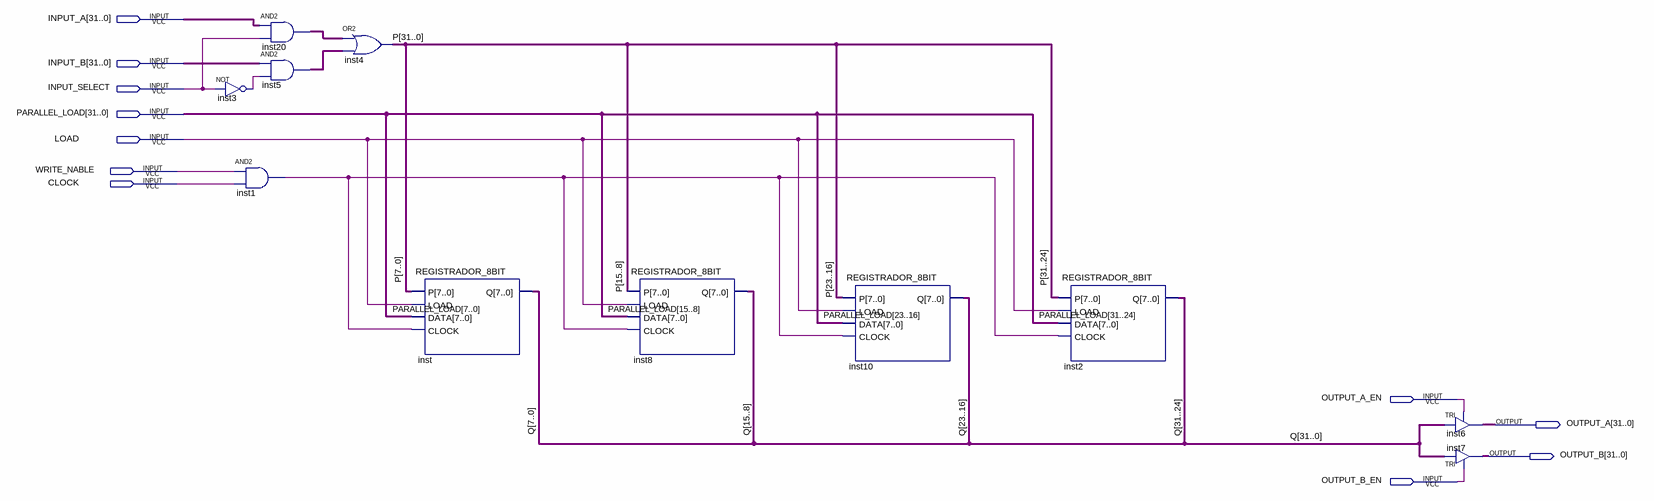
[diagram p0: schematic sheet]
// Quartus schematic REGISTRADOR_32BIT.bdf as structural Verilog: 11 symbols, 11 pins
module REGISTRADOR_32BIT (
  input  [31:0] INPUT_A,
  input  [31:0] INPUT_B,
  input  INPUT_SELECT,
  input  [31:0] PARALLEL_LOAD,
  input  LOAD,
  input  WRITE_NABLE,
  input  CLOCK,
  input  OUTPUT_A_EN,
  input  OUTPUT_B_EN,
  output [31:0] OUTPUT_A,
  output [31:0] OUTPUT_B
);

  wire inst1_out, inst3_out;
  wire [31:0] inst5_out, inst20_out, P, Q;

  not inst3 (inst3_out, INPUT_SELECT);
  and inst1 (inst1_out, WRITE_NABLE, CLOCK);
  assign inst20_out = INPUT_A & {32{INPUT_SELECT}};  // AND2 inst20, 32 bits wide
  assign inst5_out = INPUT_B & {32{inst3_out}};  // AND2 inst5, 32 bits wide
  assign P = inst20_out | inst5_out;  // OR2 inst4, 32 bits wide
  REGISTRADOR_8BIT inst (.P(P[7:0]), .LOAD(LOAD), .DATA(PARALLEL_LOAD[7:0]), .CLOCK(inst1_out), .Q(Q[7:0]));
  REGISTRADOR_8BIT inst8 (.P(P[15:8]), .LOAD(LOAD), .DATA(PARALLEL_LOAD[15:8]), .CLOCK(inst1_out), .Q(Q[15:8]));
  REGISTRADOR_8BIT inst10 (.P(P[23:16]), .LOAD(LOAD), .DATA(PARALLEL_LOAD[23:16]), .CLOCK(inst1_out), .Q(Q[23:16]));
  REGISTRADOR_8BIT inst2 (.P(P[31:24]), .LOAD(LOAD), .DATA(PARALLEL_LOAD[31:24]), .CLOCK(inst1_out), .Q(Q[31:24]));
  TRI inst6[31:0] (.IN(Q), .OE(OUTPUT_A_EN), .OUT(OUTPUT_A));
  TRI inst7[31:0] (.IN(Q), .OE(OUTPUT_B_EN), .OUT(OUTPUT_B));
endmodule
